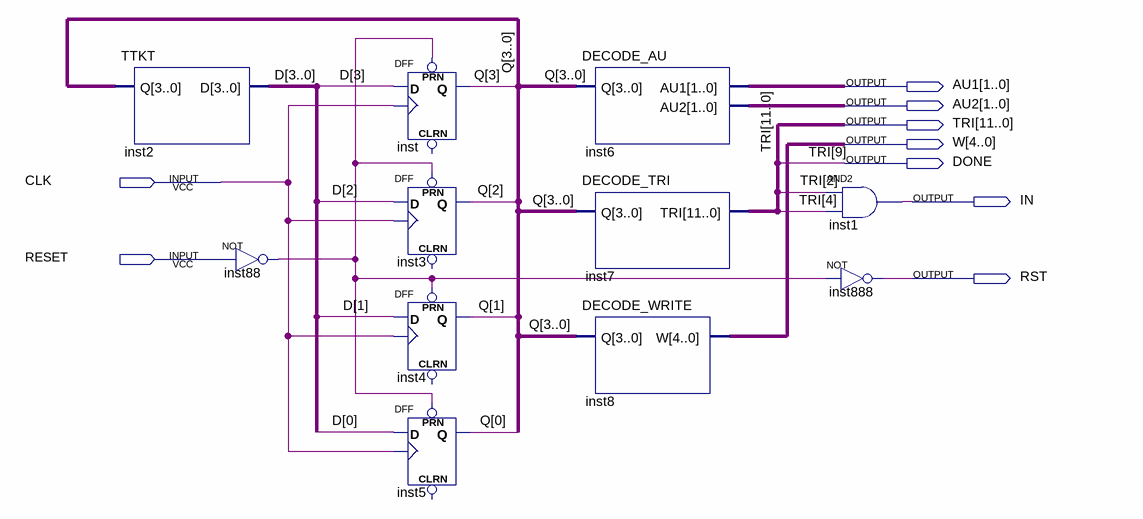
[diagram p0: schematic sheet]
// Quartus schematic CONTROL.bdf as structural Verilog: 11 symbols, 9 pins
module CONTROL (
  input  CLK,
  input  RESET,
  output [1:0] AU1,
  output [1:0] AU2,
  output [11:0] TRI,
  output [4:0] W,
  output DONE,
  output IN,
  output RST
);

  wire inst88_out;
  wire [3:0] D, Q;

  TTKT inst2 (.Q(Q), .D(D));
  not inst88 (inst88_out, RESET);
  DFF inst (.CLK(CLK), .D(D[3]), .PRN(inst88_out), .Q(Q[3]));  // open: CLRN
  DFF inst3 (.CLK(CLK), .D(D[2]), .PRN(inst88_out), .Q(Q[2]));  // open: CLRN
  DFF inst4 (.CLK(CLK), .D(D[1]), .PRN(inst88_out), .Q(Q[1]));  // open: CLRN
  DFF inst5 (.CLK(CLK), .D(D[0]), .PRN(inst88_out), .Q(Q[0]));  // open: CLRN
  DECODE_AU inst6 (.Q(Q), .AU1(AU1), .AU2(AU2));
  DECODE_TRI inst7 (.Q(Q), .TRI({TRI[11:10], DONE, TRI[8:0]}));
  DECODE_WRITE inst8 (.Q(Q), .W(W));
  and inst1 (IN, TRI[2], TRI[4]);
  not inst888 (RST, inst88_out);

  assign TRI[9] = DONE;
endmodule
